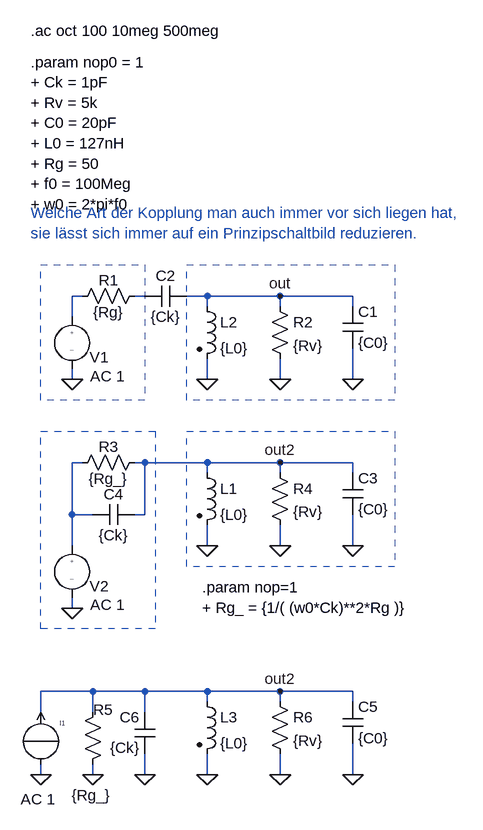
[diagram p0: schematic kapazHochpunktKopp_schwingkreis.asc]
kapazHochpunktKopp_schwingkreis.asc, the LTspice schematic file:
Version 4
SHEET 1 880 980
WIRE -176 112 -192 112
WIRE -80 112 -96 112
WIRE 16 112 -16 112
WIRE 128 112 16 112
WIRE 240 112 128 112
WIRE 16 128 16 112
WIRE 128 128 128 112
WIRE 240 128 240 112
WIRE -192 144 -192 112
WIRE -192 240 -192 224
WIRE 16 240 16 208
WIRE 128 240 128 208
WIRE 240 240 240 192
WIRE -176 368 -192 368
WIRE -80 368 -96 368
WIRE 16 368 -80 368
WIRE 128 368 16 368
WIRE 240 368 128 368
WIRE 16 384 16 368
WIRE 128 384 128 368
WIRE 240 384 240 368
WIRE -192 448 -192 368
WIRE -160 448 -192 448
WIRE -80 448 -80 368
WIRE -80 448 -96 448
WIRE -192 496 -192 448
WIRE 16 496 16 464
WIRE 128 496 128 464
WIRE 240 496 240 448
WIRE -192 592 -192 576
WIRE -160 720 -240 720
WIRE -80 720 -160 720
WIRE 16 720 -80 720
WIRE 128 720 16 720
WIRE 240 720 128 720
WIRE 16 736 16 720
WIRE 128 736 128 720
WIRE 240 736 240 720
WIRE -240 752 -240 720
WIRE -160 752 -160 720
WIRE -80 752 -80 720
WIRE -240 848 -240 832
WIRE -160 848 -160 832
WIRE -80 848 -80 816
WIRE 16 848 16 816
WIRE 128 848 128 816
WIRE 240 848 240 800
FLAG -192 240 0
FLAG 16 240 0
FLAG 128 240 0
FLAG 240 240 0
FLAG 128 112 out
FLAG -192 592 0
FLAG 16 496 0
FLAG 128 496 0
FLAG 240 496 0
FLAG 128 368 out2
FLAG 16 848 0
FLAG 128 848 0
FLAG 240 848 0
FLAG 128 720 out2
FLAG -160 848 0
FLAG -80 848 0
FLAG -240 848 0
SYMBOL res -192 128 R270
WINDOW 0 25 56 VTop 2
WINDOW 3 7 56 VBottom 2
SYMATTR InstName R1
SYMATTR Value {Rg}
SYMBOL ind2 0 112 R0
SYMATTR InstName L2
SYMATTR Value {L0}
SYMATTR Type ind
SYMBOL res 112 112 R0
SYMATTR InstName R2
SYMATTR Value {Rv}
SYMBOL cap 224 128 R0
SYMATTR InstName C1
SYMATTR Value {C0}
SYMBOL MDB_sym\\source-V -192 128 R0
WINDOW 0 27 78 Left 2
WINDOW 123 28 107 Left 2
WINDOW 39 0 0 Left 2
SYMATTR InstName V1
SYMATTR Value ""
SYMATTR Value2 AC 1
SYMBOL cap -80 128 R270
WINDOW 0 32 32 VTop 2
WINDOW 3 0 32 VBottom 2
SYMATTR InstName C2
SYMATTR Value {Ck}
SYMBOL res -192 384 R270
WINDOW 0 25 56 VTop 2
WINDOW 3 7 56 VBottom 2
SYMATTR InstName R3
SYMATTR Value {Rg_}
SYMBOL ind2 0 368 R0
SYMATTR InstName L1
SYMATTR Value {L0}
SYMATTR Type ind
SYMBOL res 112 368 R0
SYMATTR InstName R4
SYMATTR Value {Rv}
SYMBOL cap 224 384 R0
SYMATTR InstName C3
SYMATTR Value {C0}
SYMBOL MDB_sym\\source-V -192 480 R0
WINDOW 0 27 78 Left 2
WINDOW 123 28 107 Left 2
WINDOW 39 0 0 Left 2
SYMATTR InstName V2
SYMATTR Value ""
SYMATTR Value2 AC 1
SYMBOL cap -160 464 R270
WINDOW 0 32 32 VTop 2
WINDOW 3 0 32 VBottom 2
SYMATTR InstName C4
SYMATTR Value {Ck}
SYMBOL res -144 736 M0
WINDOW 0 -15 12 Left 2
WINDOW 3 -12 144 Left 2
SYMATTR InstName R5
SYMATTR Value {Rg_}
SYMBOL ind2 0 720 R0
SYMATTR InstName L3
SYMATTR Value {L0}
SYMATTR Type ind
SYMBOL res 112 720 R0
SYMATTR InstName R6
SYMATTR Value {Rv}
SYMBOL cap 224 736 R0
SYMATTR InstName C5
SYMATTR Value {C0}
SYMBOL cap -64 752 M0
WINDOW 3 24 55 Left 2
SYMATTR InstName C6
SYMATTR Value {Ck}
SYMBOL MDB_sym\\source-I -240 752 R0
WINDOW 123 -31 134 Left 2
WINDOW 39 0 0 Left 2
SYMATTR InstName I1
SYMATTR Value ""
SYMATTR Value2 AC 1
TEXT -256 -248 Left 2 !.param nop0 = 1\n+ Ck = 1pF\n+ Rv = 5k\n+ C0 = 20pF\n+ L0 = 127nH\n+ Rg = 50\n+ f0 = 100Meg\n+ w0 = 2*pi*f0
TEXT -256 -296 Left 2 !.ac oct 100 10meg 500meg
TEXT -256 -16 Left 2 ;Welche Art der Kopplung man auch immer vor sich liegen hat,\nsie lässt sich immer auf ein Prinzipschaltbild reduzieren.
TEXT 8 560 Left 2 !.param nop=1\n+ Rg_ = {1/( (w0*Ck)**2*Rg )}
RECTANGLE Normal -80 272 -240 64 2
RECTANGLE Normal 304 272 -16 64 2
RECTANGLE Normal -64 624 -240 320 2
RECTANGLE Normal 304 528 -16 320 2

The netlist it stands for:
* kapazHochpunktKopp_schwingkreis.asc
R1 N001 N002 {Rg}
L2 out 0 {L0}
R2 out 0 {Rv}
C1 out 0 {C0}
V1 N001 0 AC 1
C2 N002 out {Ck}
R3 N003 out2 {Rg_}
L1 out2 0 {L0}
R4 out2 0 {Rv}
C3 out2 0 {C0}
V2 N003 0 AC 1
C4 N003 out2 {Ck}
R5 out2 0 {Rg_}
L3 out2 0 {L0}
R6 out2 0 {Rv}
C5 out2 0 {C0}
C6 out2 0 {Ck}
I1 0 out2 AC 1
.param nop0 = 1
+ Ck = 1pF
+ Rv = 5k
+ C0 = 20pF
+ L0 = 127nH
+ Rg = 50
+ f0 = 100Meg
+ w0 = 2*pi*f0
.ac oct 100 10meg 500meg
* Welche Art der Kopplung man auch immer vor sich liegen hat,
* sie lässt sich immer auf ein Prinzipschaltbild reduzieren.
.param nop=1
+ Rg_ = {1/( (w0*Ck)**2*Rg )}
.backanno
.end